# Altium schematic sheet lecteur_8.SchDoc
size A4
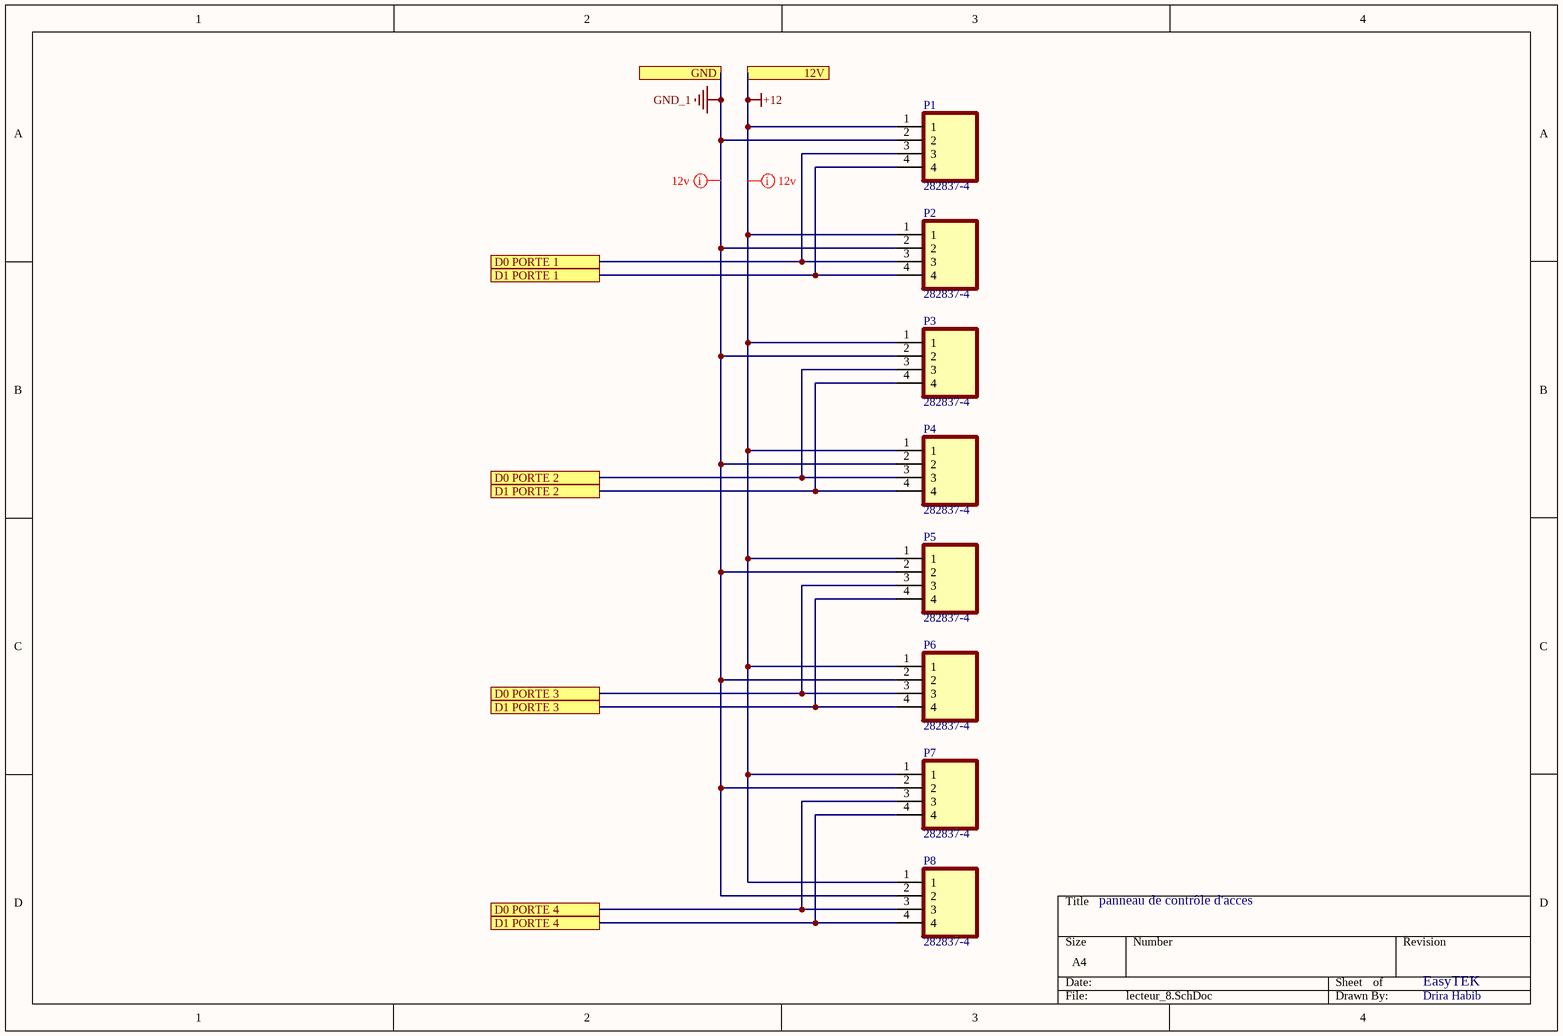
[diagram p0: lecteur_8.SchDoc]

## Parts
P1  282837-4  [TE_282837-4]
P2  282837-4  [TE_282837-4]
P3  282837-4  [TE_282837-4]
P4  282837-4  [TE_282837-4]
P5  282837-4  [TE_282837-4]
P6  282837-4  [TE_282837-4]
P7  282837-4  [TE_282837-4]
P8  282837-4  [TE_282837-4]

## Ports
12V, D0 PORTE 1, D0 PORTE 2, D0 PORTE 3, D0 PORTE 4, D1 PORTE 1, D1 PORTE 2, D1 PORTE 3, D1 PORTE 4, GND

## Nets
+12: P1.1 P2.1 P3.1 P4.1 P5.1 P6.1 P7.1 P8.1 ; port 12V
GND_1: P1.2 P2.2 P3.2 P4.2 P5.2 P6.2 P7.2 P8.2 ; port GND
D0 PORTE 1: P1.3 P2.3 ; port D0 PORTE 1
D0 PORTE 2: P3.3 P4.3 ; port D0 PORTE 2
D0 PORTE 3: P5.3 P6.3 ; port D0 PORTE 3
D0 PORTE 4: P7.3 P8.3 ; port D0 PORTE 4
D1 PORTE 1: P1.4 P2.4 ; port D1 PORTE 1
D1 PORTE 2: P3.4 P4.4 ; port D1 PORTE 2
D1 PORTE 3: P5.4 P6.4 ; port D1 PORTE 3
D1 PORTE 4: P7.4 P8.4 ; port D1 PORTE 4

## Layout directives
net class 12: +12, GND_1

## Notes on the sheet
- panneau de contrôle d'acces
- EasyTEK
- Drira Habib

## Library data of the parts
P1-P8 = 282837-4: 4 Position Wire to Board Terminal Block Horizontal with Board 0.200 (5.08mm) Through Hole; MF: TE Connectivity; Value: *; SnapEDA_Link: https://www.snapeda.com/parts/282837-4/TE+Connectivity+AMP+Connectors/view-part/?ref=snap; Purchase-URL: https://pricing.snapeda.com/search/part/282837-4/?ref=eda; EU_RoHS_Compliance: Compliant with Exemptions; Availability: In Stock; Price: None; Package: None; Check_prices: https://www.snapeda.com/parts/282837-4/TE+Connectivity+AMP+Connectors/view-part/?ref=eda; MP: 282837-4